# EAGLE schematic Stepper_Driver_Design (EAGLE 9.6.2)
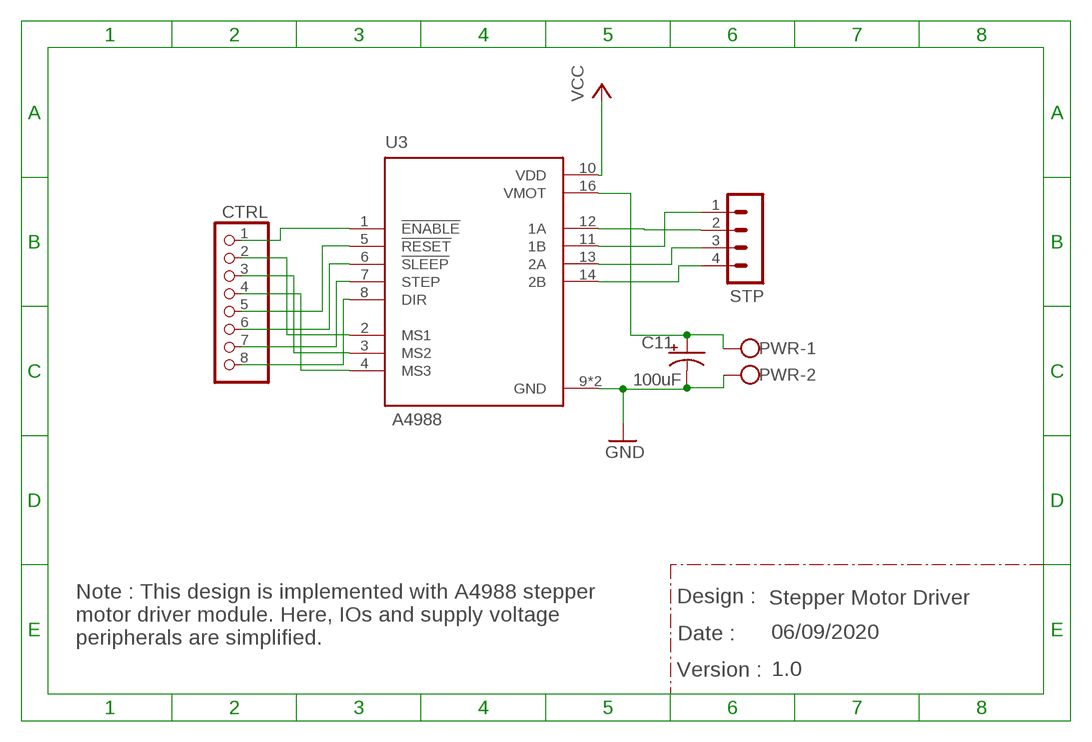
[diagram p0: schematic, sheet 1]

## Parts
C11  100uF  CPOL-US140CLH-1010  [140CLH-1010]
CTRL  PINHD-1X8BIG  [1X08-BIG]
PWR  W237-102  [W237-102]
STP  MA04-1  [MA04-1]
U3  A4988  A4988_STEPPER_MOTOR_DRIVER_CARRIER  [MODULE_A4988_STEPPER_MOTOR_DRIVER_CARRIER]

## Nets
GND: C11.- PWR.2 U3.9(GND) U3.15(GND)
N$5: C11.+ PWR.1 U3.16(VMOT)
N$8: STP.4 U3.14(2B)
N$11: STP.2 U3.12(1A)
N$13: STP.3 U3.13(2A)
N$14: STP.1 U3.11(1B)
N$15: CTRL.1 U3.1(!ENABLE)
N$16: CTRL.2 U3.2(MS1)
N$17: CTRL.3 U3.3(MS2)
N$18: CTRL.4 U3.4(MS3)
N$19: CTRL.5 U3.5(!RESET)
N$20: CTRL.6 U3.6(!SLEEP)
N$21: CTRL.7 U3.7(STEP)
N$22: CTRL.8 U3.8(DIR)
VCC: U3.10(VDD)

## Notes on the sheet
- Design : | Stepper Motor Driver
- Date : | 06/09/2020
- Note : This design is implemented with A4988 stepper
  motor driver module. Here, IOs and supply voltage
  peripherals are simplified.
- Version : | 1.0

## Library data of the parts
C11 = adafruit:CPOL-US: POLARIZED CAPACITOR, American symbol
CTRL = adafruit:PINHD-1X8: PIN HEADER
PWR = con-wago-500:W237-102: WAGO SCREW CLAMP; MPN: 237-102; OC_FARNELL: unknown; OC_NEWARK: 70K9898
STP = con-lstb:MA04-1: PIN HEADER; OC_FARNELL: unknown; OC_NEWARK: unknown
U3 = A4988_STEPPER_MOTOR_DRIVER_CARRIER:A4988_STEPPER_MOTOR_DRIVER_CARRIER: Stepper motor controler; IC: A4988; 1A; Uin mot: 8÷35V; AVAILABILITY: Unavailable; DESCRIPTION: Stepper Motor Driver; MF: Pololu; MP: A4988 STEPPER MOTOR DRIVER CARRIER; PACKAGE: None; PRICE: None